# EAGLE design lazurite_rev3_3 (EAGLE 7.6.0)

## Sheet 1 of 2
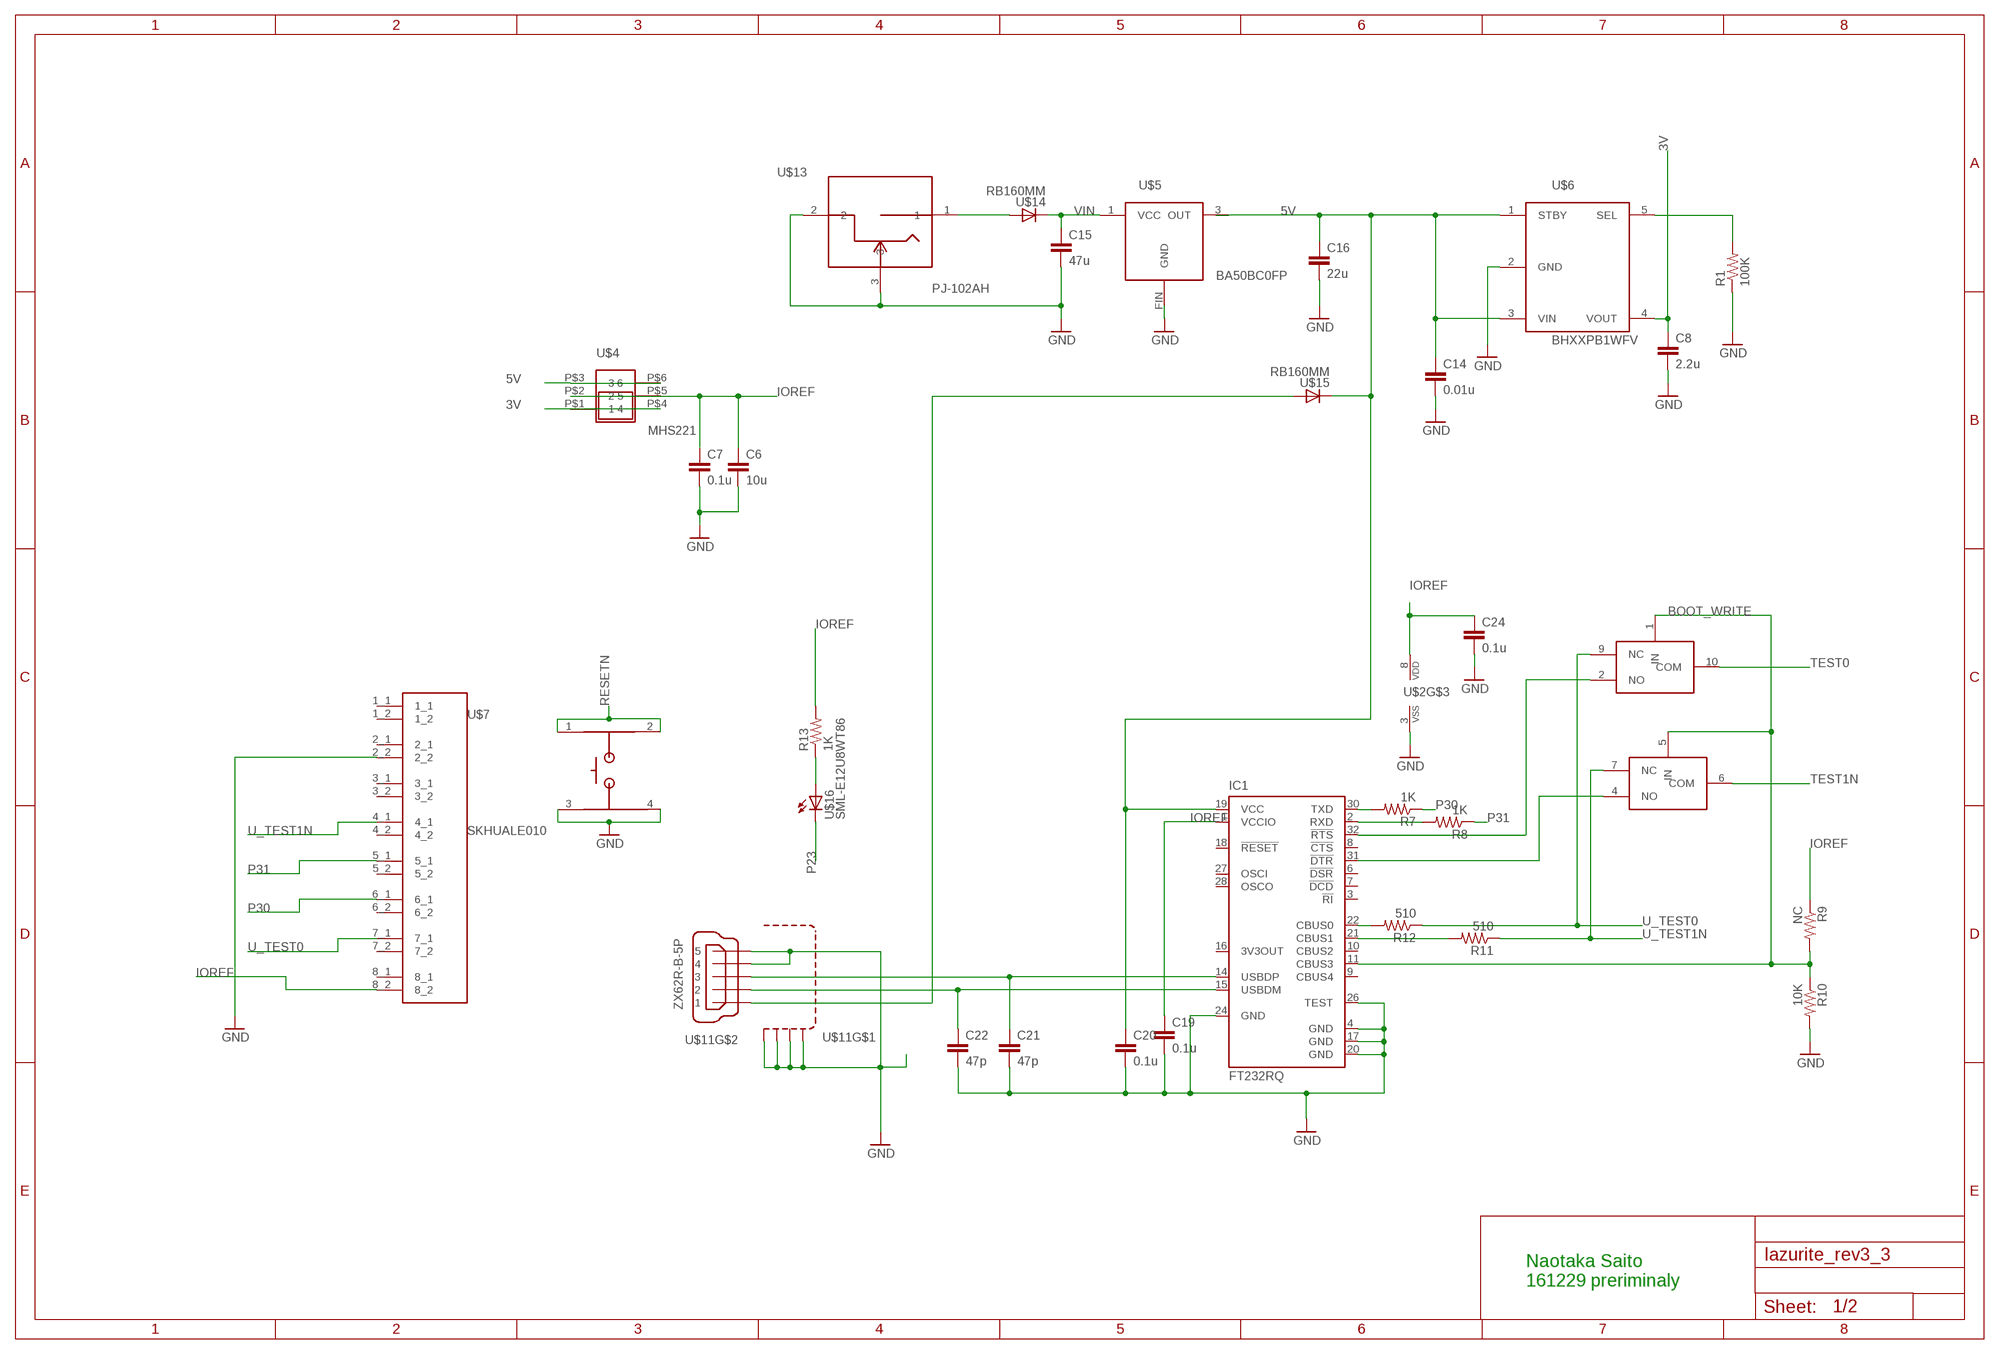
[diagram p0: schematic, sheet 1]

### Parts
C6  10u  C-EUC0402  [C0402]
C7  0.1u  C-EUC0402  [C0402]
C8  2.2u  C-EUC0402  [C0402]
C14  0.01u  C-EUC0402  [C0402]
C15  47u  C-EUC1210  [C1210]
C16  22u  C-EUC1206  [C1206]
C19  0.1u  C-EUC0402  [C0402]
C20  0.1u  C-EUC0402  [C0402]
C21  47p  C-EUC0402  [C0402]
C22  47p  C-EUC0402  [C0402]
C24  0.1u  C-EUC0402  [C0402]
IC1  FT232RQ  [QFN32]
R1  100K  R-US_R0402  [R0402]
R7  1K  R-US_R0402  [R0402]
R8  1K  R-US_R0402  [R0402]
R9  NC  R-US_R0402  [R0402]
R10  10K  R-US_R0402  [R0402]
R11  510  R-US_R0402  [R0402]
R12  510  R-US_R0402  [R0402]
R13  1K  R-US_R0402  [R0402]
U$2  TI-TS5A23159  [UQFN10]
U$4  MHS221  [MHS221]
U$5  BA50BC0FP  [TO252-3]
U$6  BHXXPB1WFV  [HVSOF5]
U$7  SKHUALE010  [SKHUALE010]
U$11  ZX62R-B-5P  MICRO-USB-SHIELD-ZX62R-B-5P  [ZX62R-B-5P]
U$12  XB-1-X  [XB-1-X]
U$13  PJ-102AH  [PJ-102H]
U$14  RB160MM  [RB160MM-30]
U$15  RB160MM  [RB160MM-30]
U$16  SML-E12U8WT86  SML-E1X  [SML-E1X]

### Nets
3V: C8.1 U$4.P$1 U$4.P$4 U$6.4(VOUT) ; also sheet 2
5V: C14.1 C16.1 C20.1 IC1.19(VCC) U$4.P$3 U$4.P$6 U$5.3(OUT) U$6.1(STBY) U$6.3(VIN) U$15.C ; also sheet 2
BOOT_WRITE: IC1.11(CBUS3) R9.2 R10.1 U$2.1(IN) U$2.5(IN)
DM: C22.1 IC1.15(USBDM) U$11.2
DP: C21.1 IC1.14(USBDP) U$11.3
GND: C6.2 C7.2 C8.2 C14.2 C15.2 C16.2 C19.2 C20.2 C21.2 C22.2 C24.2 IC1.4(GND) IC1.17(GND) IC1.20(GND) IC1.24(GND) IC1.26(TEST) R1.1 R10.2 U$2.3(VSS) U$5.FIN(GND) U$6.2(GND) U$7.3 U$7.4 U$11.4 U$11.5 U$11.M1(S1) U$11.M2(S2) U$11.M3(S3) U$11.M4(S4) U$12.2_2 U$13.2 U$13.3 ; also sheet 2
IOREF: C6.1 C7.1 C19.1 C24.1 IC1.1(VCCIO) R9.1 R13.2 U$2.8(VDD) U$4.P$2 U$4.P$5 U$12.8_2 ; also sheet 2
N$4: IC1.30(TXD) R7.2
N$6: IC1.22(CBUS0) R12.2
N$9: IC1.31(!DTR) U$2.4(NO)
N$10: IC1.2(RXD) R8.2
N$11: IC1.21(CBUS1) R11.2
N$16: R1.2 U$6.5(SEL)
N$17: IC1.32(!RTS) U$2.2(NO)
N$18: U$13.1 U$14.A
N$19: R13.1 U$16.A
P23: U$16.C ; also sheet 2
P30: R7.1 U$12.6_1 ; also sheet 2
P31: R8.1 U$12.5_1 ; also sheet 2
RESETN: U$7.1 U$7.2 ; also sheet 2
TEST0: U$2.10(COM) ; also sheet 2
TEST1N: U$2.6(COM) ; also sheet 2
U_TEST0: R12.1 U$2.9(NC) U$12.7_1
U_TEST1N: R11.1 U$2.7(NC) U$12.4_1
USBVDD: U$11.1 U$15.A
VIN: C15.1 U$5.1(VCC) U$14.C ; also sheet 2
Unconnected: IC1.3(!RI) IC1.6(!DSR) IC1.7(!DCD) IC1.8(!CTS) IC1.9(CBUS4) IC1.10(CBUS2) IC1.16(3V3OUT) IC1.18(!RESET) IC1.27(OSCI) IC1.28(OSCO) U$12.1_1 U$12.1_2 U$12.2_1 U$12.3_1 U$12.3_2 U$12.4_2 U$12.5_2 U$12.6_2 U$12.7_2 U$12.8_1

### Notes on the sheet
- Naotaka Saito
  161229 preriminaly

## Sheet 2 of 2
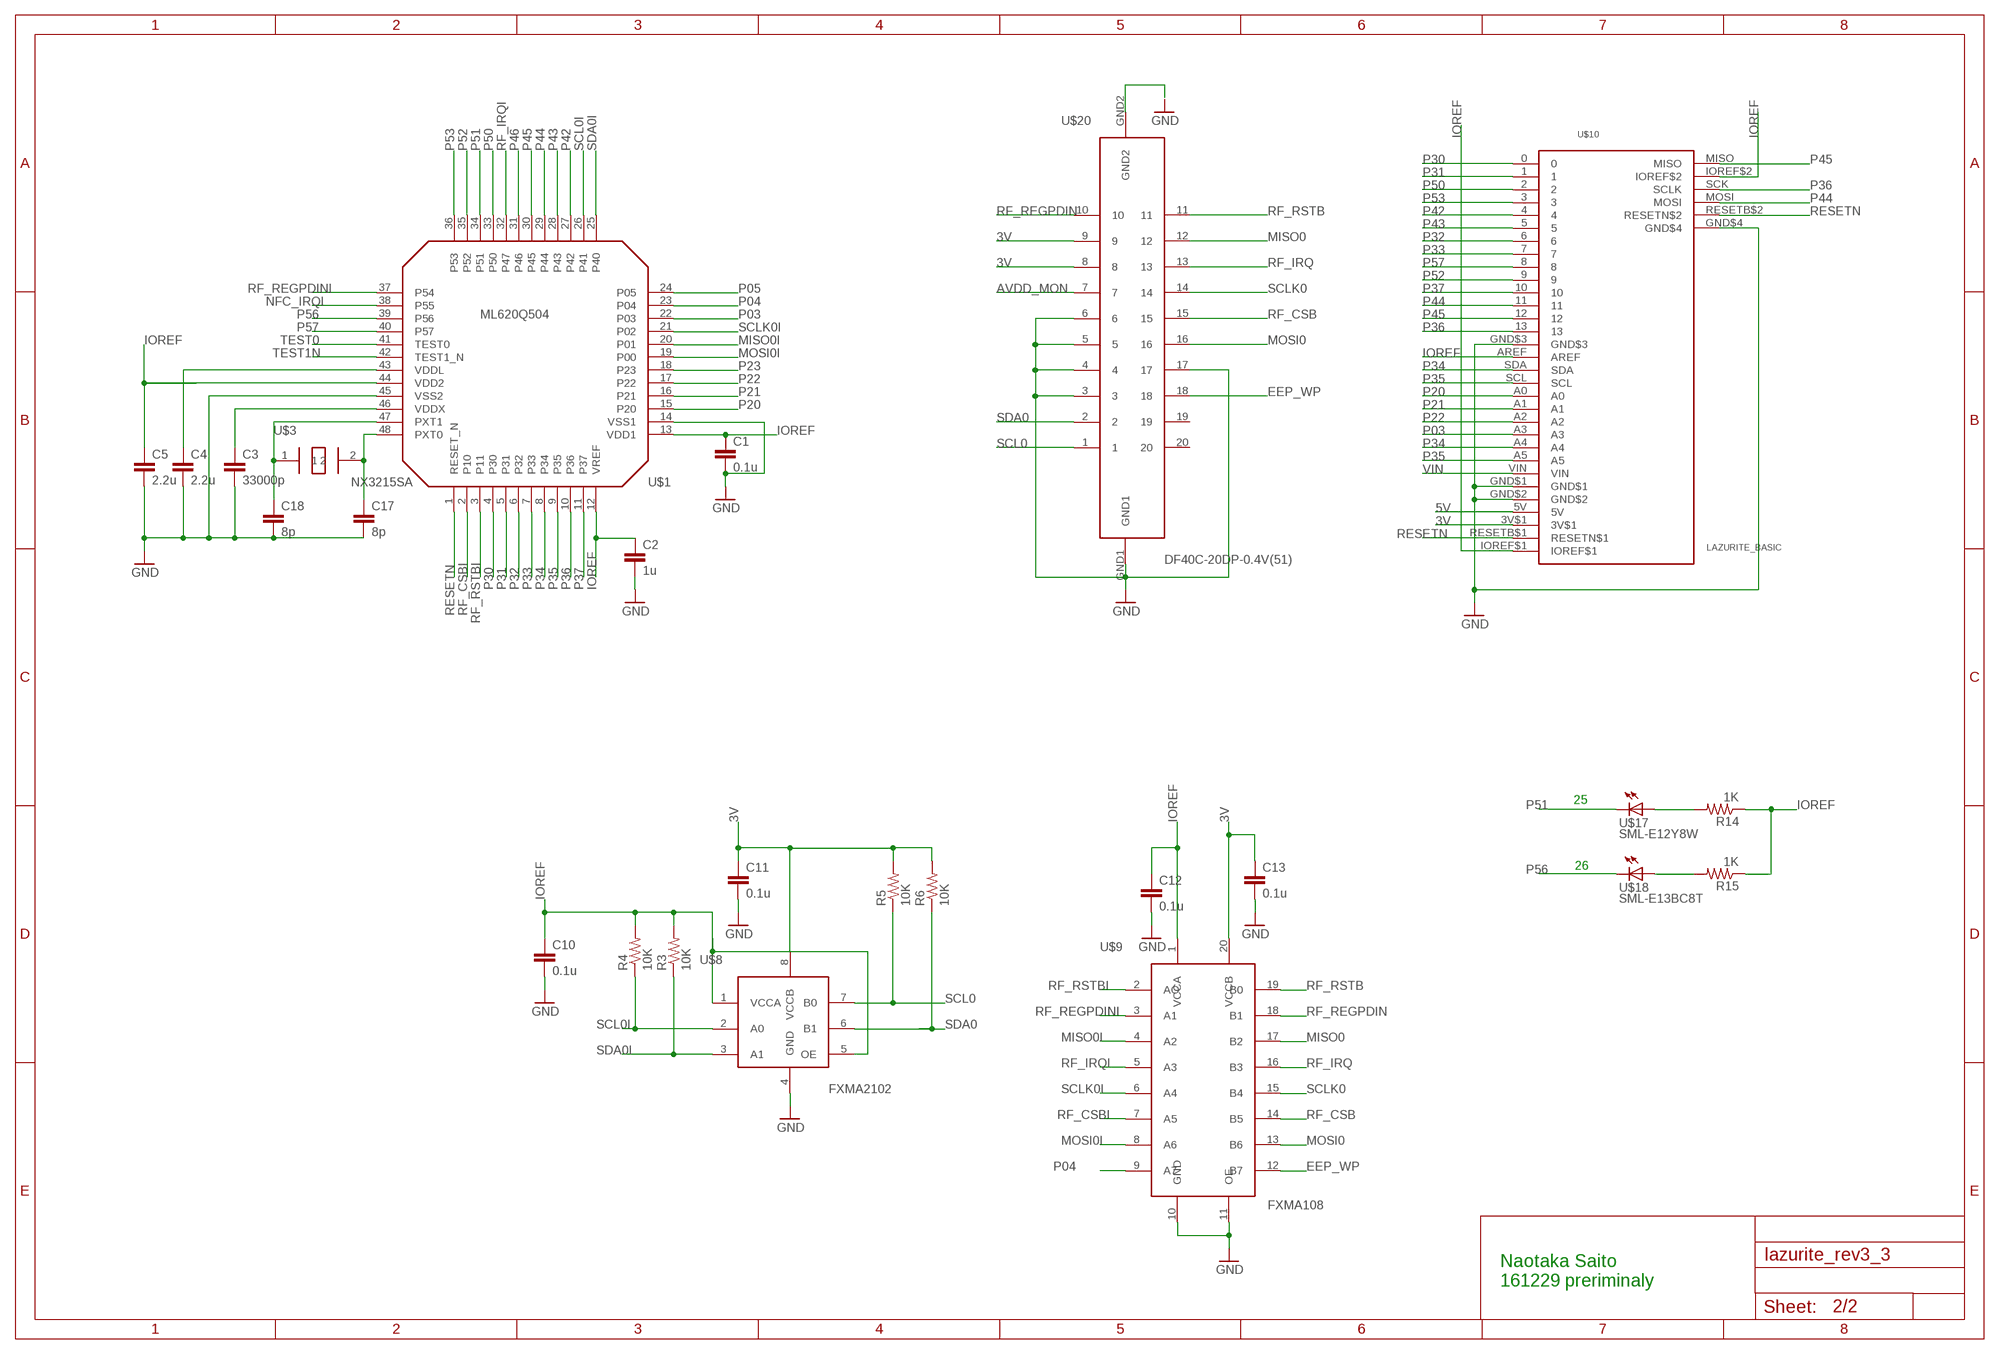
[diagram p1: schematic, sheet 2]

### Parts
C1  0.1u  C-EUC0402  [C0402]
C2  1u  C-EUC0402  [C0402]
C3  33000p  C-EUC0402  [C0402]
C4  2.2u  C-EUC0402  [C0402]
C5  2.2u  C-EUC0402  [C0402]
C10  0.1u  C-EUC0402  [C0402]
C11  0.1u  C-EUC0402  [C0402]
C12  0.1u  C-EUC0402  [C0402]
C13  0.1u  C-EUC0402  [C0402]
C17  8p  C-EUC0402  [C0402]
C18  8p  C-EUC0402  [C0402]
R3  10K  R-US_R0402  [R0402]
R4  10K  R-US_R0402  [R0402]
R5  10K  R-US_R0402  [R0402]
R6  10K  R-US_R0402  [R0402]
R14  1K  R-US_R0402  [R0402]
R15  1K  R-US_R0402  [R0402]
U$1  ML620Q504  [ML620Q504]
U$3  NX3215SA  [NX3215SA-32,768K-SFD-MUA-14]
U$8  FXMA2102  [MICROPACK]
U$9  FXMA108  [FXMA108]
U$10  LAZURITE_BASIC  [LAZURITE_BASIC]
U$17  SML-E12Y8W  SML-E1X  [SML-E1X]
U$18  SML-E13BC8T  SML-E1X  [SML-E1X]
U$20  DF40C-20DP-0.4V(51)  BP3596A  [BP3596A]

### Nets
3V: C11.1 C13.1 R5.2 R6.2 U$8.8(VCCB) U$9.20(VCCB) U$10.3V$1 U$20.8 U$20.9 ; also sheet 1
5V: U$10.5V ; also sheet 1
AVDD_MON: U$20.7
EEP_WP: U$9.12(B7) U$20.18
GND: C1.2 C2.2 C3.2 C4.2 C5.2 C10.2 C11.2 C12.2 C13.2 C17.2 C18.2 U$1.14(VSS1) U$1.45(VSS2) U$8.4(GND) U$9.10(GND) U$9.11(OE) U$10.GND$1 U$10.GND$2 U$10.GND$3 U$10.GND$4 U$20.3 U$20.4 U$20.5 U$20.6 U$20.17 U$20.GND1 ; also sheet 1
IOREF: C1.1 C2.1 C5.1 C10.1 C12.1 R3.2 R4.2 R14.1 R15.1 U$1.12(VREF) U$1.13(VDD1) U$1.44(VDD2) U$8.1(VCCA) U$8.5(OE) U$9.1(VCCA) U$10.AREF U$10.IOREF$1 U$10.IOREF$2 ; also sheet 1
MISO0: U$9.17(B2) U$20.12
MISO0I: U$1.20(P01) U$9.4(A2)
MOSI0: U$9.13(B6) U$20.16
MOSI0I: U$1.19(P00) U$9.8(A6)
N$1: C17.1 U$1.48(PXT0) U$3.2
N$2: C18.1 U$1.47(PXT1) U$3.1
N$3: C3.1 U$1.46(VDDX)
N$5: R14.2 U$17.A
N$7: C4.1 U$1.43(VDDL)
N$22: R15.2 U$18.A
N$24: U$20.GND2
NFC_IRQI: U$1.38(P55)
P03: U$1.22(P03) U$10.A3
P04: U$1.23(P04) U$9.9(A7)
P05: U$1.24(P05)
P20: U$1.15(P20) U$10.A0
P21: U$1.16(P21) U$10.A1
P22: U$1.17(P22) U$10.A2
P23: U$1.18(P23) ; also sheet 1
P30: U$1.4(P30) U$10.0 ; also sheet 1
P31: U$1.5(P31) U$10.1 ; also sheet 1
P32: U$1.6(P32) U$10.6
P33: U$1.7(P33) U$10.7
P34: U$1.8(P34) U$10.A4 U$10.SDA
P35: U$1.9(P35) U$10.A5 U$10.SCL
P36: U$1.10(P36) U$10.13 U$10.SCK(SCLK)
P37: U$1.11(P37) U$10.10
P42: U$1.27(P42) U$10.4
P43: U$1.28(P43) U$10.5
P44: U$1.29(P44) U$10.11 U$10.MOSI
P45: U$1.30(P45) U$10.12 U$10.MISO
P46: U$1.31(P46)
P50: U$1.33(P50) U$10.2
P51: U$1.34(P51) U$17.C
P52: U$1.35(P52) U$10.9
P53: U$1.36(P53) U$10.3
P56: U$1.39(P56) U$18.C
P57: U$1.40(P57) U$10.8
RESETN: U$1.1(RESET_N) U$10.RESETB$1(RESETN$1) U$10.RESETB$2(RESETN$2) ; also sheet 1
RF_CSB: U$9.14(B5) U$20.15
RF_CSBI: U$1.2(P10) U$9.7(A5)
RF_IRQ: U$9.16(B3) U$20.13
RF_IRQI: U$1.32(P47) U$9.5(A3)
RF_REGPDIN: U$9.18(B1) U$20.10
RF_REGPDINI: U$1.37(P54) U$9.3(A1)
RF_RSTB: U$9.19(B0) U$20.11
RF_RSTBI: U$1.3(P11) U$9.2(AO)
SCL0: R5.1 U$8.7(B0) U$20.1
SCL0I: R4.1 U$1.26(P41) U$8.2(A0)
SCLK0: U$9.15(B4) U$20.14
SCLK0I: U$1.21(P02) U$9.6(A4)
SDA0: R6.1 U$8.6(B1) U$20.2
SDA0I: R3.1 U$1.25(P40) U$8.3(A1)
TEST0: U$1.41(TEST0) ; also sheet 1
TEST1N: U$1.42(TEST1_N) ; also sheet 1
VIN: U$10.VIN ; also sheet 1
Unconnected: U$20.19 U$20.20

### Notes on the sheet
- 25
- 26
- Naotaka Saito
  161229 preriminaly

## Library data of the parts
C1-C8 C10-C22 C24 = rcl:C-EU: CAPACITOR, European symbol
IC1 = ftdichip:FT232R: Source: http://www.ftdichip.com/Documents/DataSheets/DS_FT232R_v104.pdf; MPN: FT232RQ; OC_FARNELL: 1146033; OC_NEWARK: 91K9919
R1 R3-R15 = rcl:R-US_: RESISTOR, American symbol
U$1 = lazurite:ML620Q504
U$2 = lz-shield:TI-TS5A23159
U$3 = lazurite:NX3215SA
U$4 = lazurite:MHS221
U$5 = lazurite:BA50BC0FP
U$6 = lazurite:BHXXPB1WFV
U$7 = lazurite:SKHUALE010
U$8 = lazurite:FXMA2102
U$9 = lazurite:FXMA108
U$10 = lazurite:LAZURITE_BASIC
U$11 = con-hirose:MICRO-USB-SHIELD-: Hirose Micro USB Connector ZX62R-B-5P: Micro B, reverse (top mount) shell SMT Supplier: DigiKey H11574CT-ND Source: http://www.hirose.co.jp/cataloge_hp/e24200011.pdf
U$12 = lz-shield:XB-1-X
U$13 = lazurite:PJ-102AH
U$14 U$15 = lazurite:RB160MM
U$16-U$18 = lazurite:SML-E1X
U$20 = lazurite:BP3596A

## Board
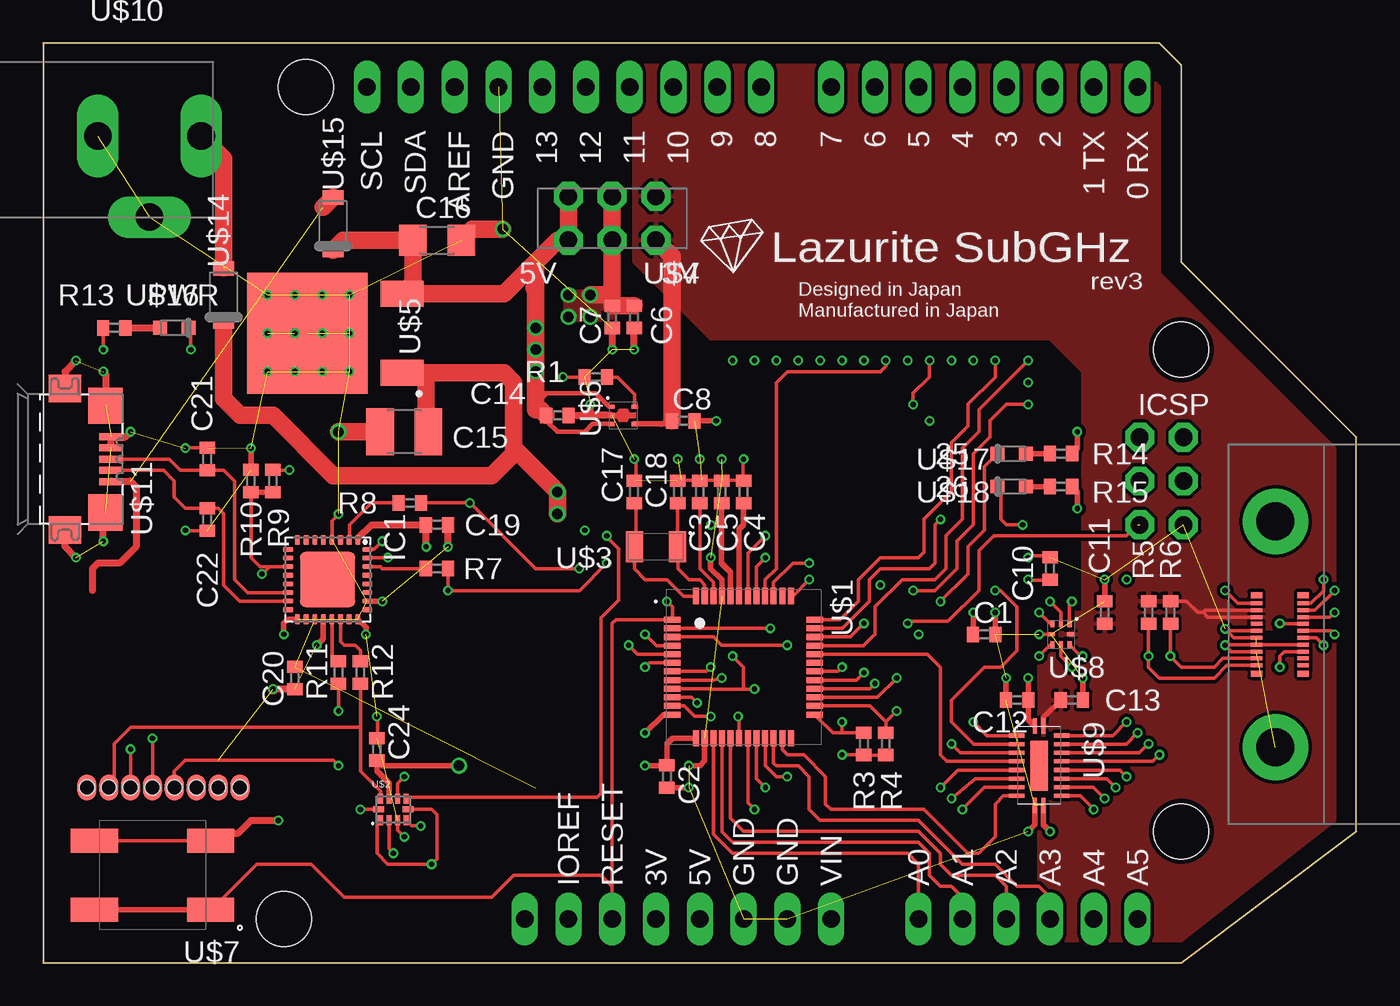
[diagram p2: board, top side]
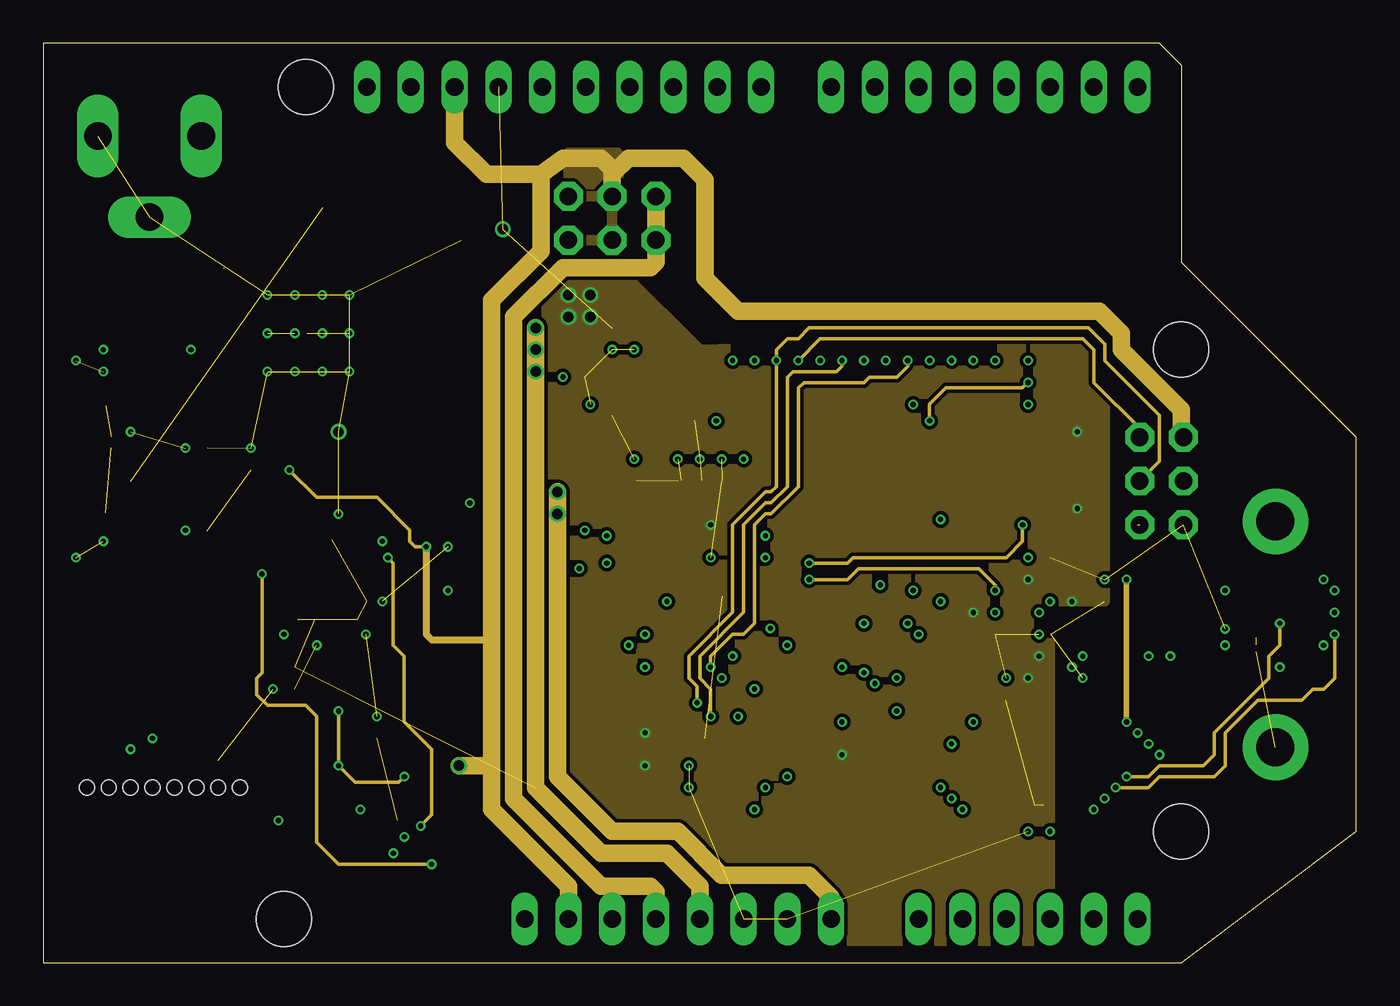
[diagram p3: board, inner layer Route2]
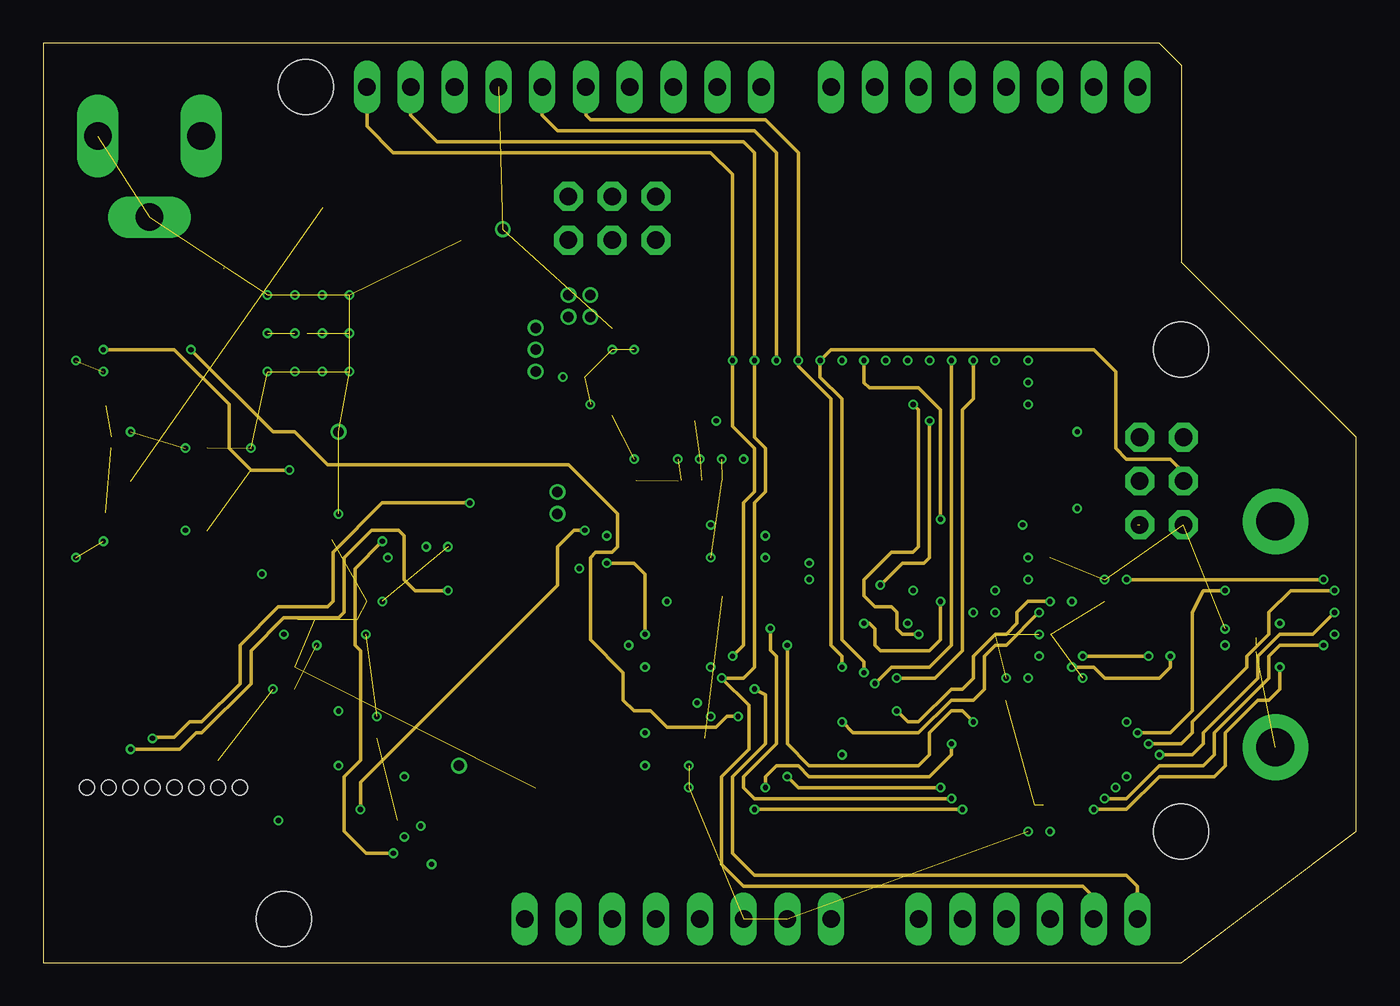
[diagram p4: board, inner layer Route3]
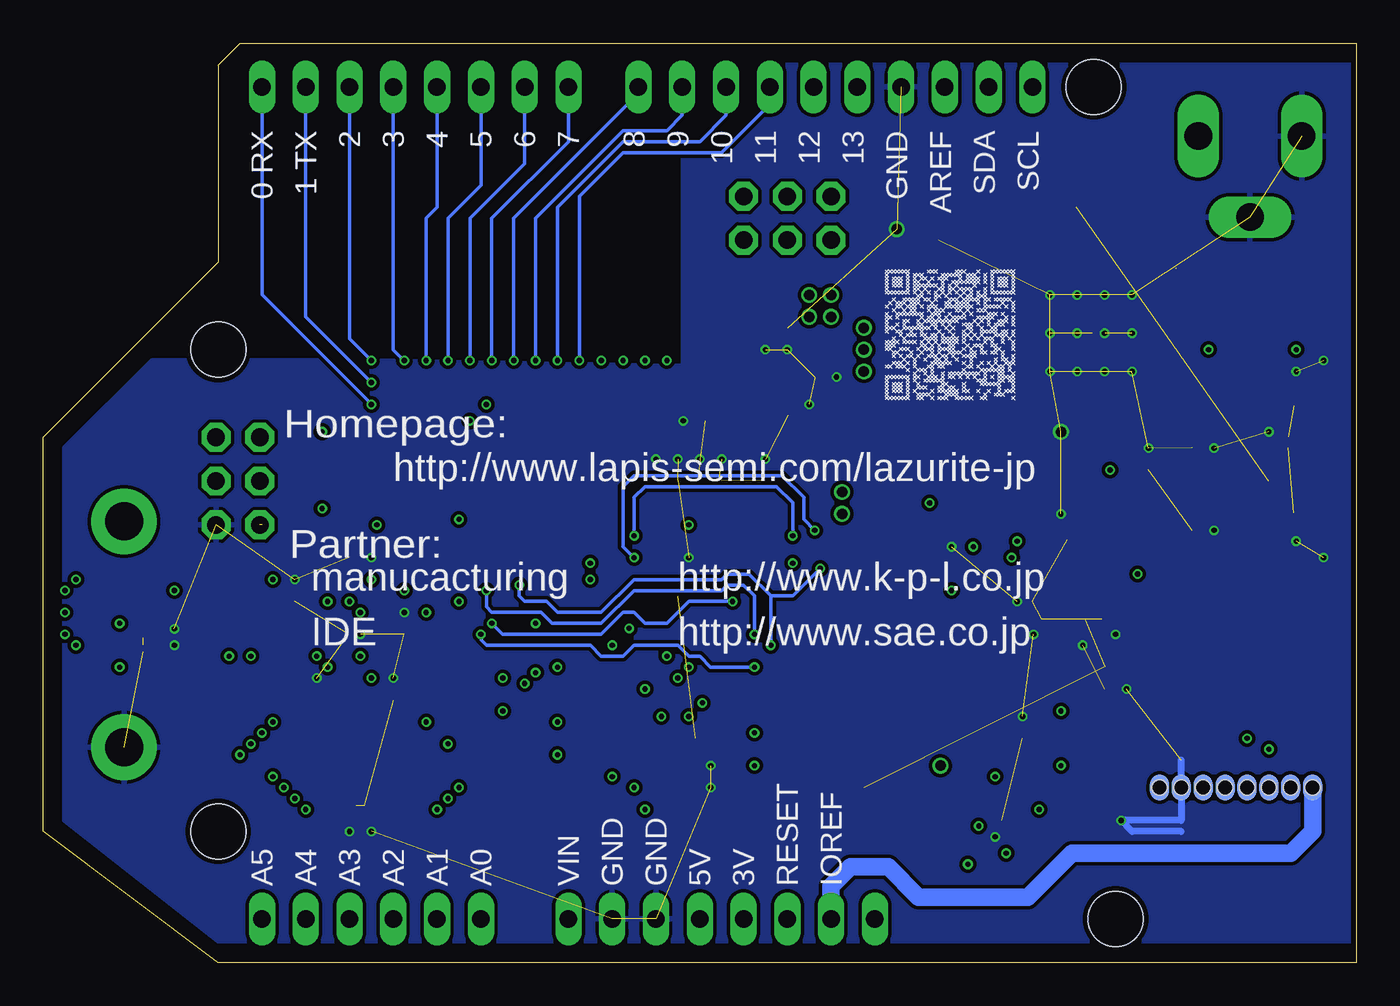
[diagram p5: board, bottom side, seen from below]

Size 76.2 x 53.34 mm. Coordinates in mm from the lower left corner, seen from the top.
Outline: 0,0 66.04,0 76.2,7.62 76.2,30.48 66.04,40.64 66.04,52.07 64.77,53.34 0,53.34 0,0
Copper layers (1+2*3+16): Top 0.018mm / dielectric 0.36mm / Route2 0.035mm / dielectric 0.71mm / Route3 0.035mm / dielectric 0.36mm / Bottom 0.018mm
Design rules "unicraft_4_layer": minimum track width 0.125mm, minimum drill 0.3mm, track to track 0.125mm, track to pad 0.125mm, pad to pad 0.125mm, via to via 0.125mm, smd to smd 0mil, copper to edge 0.3mm, drill to drill 0.2mm, minimum pad ring 0.125mm, minimum via ring 0.125mm, stop-mask expansion 2mil, vias tented up to drill 0.45mm, thermal gap 0.2mm

### Footprints (pad centres in the part's own frame; a part is rotated, then mirrored left to right if it is on the bottom)
C0402 = smd 0.7 x 0.9: 1 -0.65,0; 2 0.65,0
C1210 = smd 1.6 x 2.7: 1 -1.4,0; 2 1.4,0
C1206 = smd 1.6 x 1.8: 1 -1.4,0; 2 1.4,0
QFN32 = smd 0.6 x 0.3: 1 -2.3,1.75; 2 -2.3,1.25; 3 -2.3,0.75; 4 -2.3,0.25; 5 -2.3,-0.25; 6 -2.3,-0.75; 7 -2.3,-1.25; 8 -2.3,-1.75; 17 2.3,-1.75; 18 2.3,-1.25; 19 2.3,-0.75; 20 2.3,-0.25; 21 2.3,0.25; 22 2.3,0.75; 23 2.3,1.25; 24 2.3,1.75 | smd 0.3 x 0.6: 9 -1.75,-2.3; 10 -1.25,-2.3; 11 -0.75,-2.3; 12 -0.25,-2.3; 13 0.25,-2.3; 14 0.75,-2.3; 15 1.25,-2.3; 16 1.75,-2.3; 25 1.75,2.3; 26 1.25,2.3; 27 0.75,2.3; 28 0.25,2.3; 29 -0.25,2.3; 30 -0.75,2.3; 31 -1.25,2.3; 32 -1.75,2.3 | smd 3.2 x 3.2: EXP 0,0
R0402 = smd 0.7 x 0.9: 1 -0.65,0; 2 0.65,0
ML620Q504 = smd 0.35 x 0.95: 1 -2.75,-4.125; 2 -2.25,-4.125; 3 -1.75,-4.125; 4 -1.25,-4.125; 5 -0.75,-4.125; 6 -0.25,-4.125; 7 0.25,-4.125; 8 0.75,-4.125; 9 1.25,-4.125; 10 1.75,-4.125; 11 2.25,-4.125; 12 2.75,-4.125; 25 2.75,4.125; 26 2.25,4.125; 27 1.75,4.125; 28 1.25,4.125; 29 0.75,4.125; 30 0.25,4.125; 31 -0.25,4.125; 32 -0.75,4.125; 33 -1.25,4.125; 34 -1.75,4.125; 35 -2.25,4.125; 36 -2.75,4.125 | smd 0.95 x 0.35: 13 4.125,-2.75; 14 4.125,-2.25; 15 4.125,-1.75; 16 4.125,-1.25; 17 4.125,-0.75; 18 4.125,-0.25; 19 4.125,0.25; 20 4.125,0.75; 21 4.125,1.25; 22 4.125,1.75; 23 4.125,2.25; 24 4.125,2.75; 37 -4.125,2.75; 38 -4.125,2.25; 39 -4.125,1.75; 40 -4.125,1.25; 41 -4.125,0.75; 42 -4.125,0.25; 43 -4.125,-0.25; 44 -4.125,-0.75; 45 -4.125,-1.25; 46 -4.125,-1.75; 47 -4.125,-2.25; 48 -4.125,-2.75
UQFN10 = smd 0.3 x 0.58: 1 -0.75,-0.635; 2 -0.25,-0.635; 3 0.25,-0.635; 4 0.75,-0.635; 6 0.75,0.635; 7 0.25,0.635; 8 -0.25,0.635; 9 -0.75,0.635 | smd 0.63 x 0.35: 5 0.86,0; 10 -0.86,0
NX3215SA-32,768K-SFD-MUA-14 = smd 1 x 1.8: 1 -1.25,0; 2 1.25,0
MHS221 = drill 1.016 pad 1.676 octagon: P$1 -2.54,1.27; P$2 0,1.27; P$3 2.54,1.27; P$4 -2.54,-1.27; P$5 0,-1.27; P$6 2.54,-1.27
TO252-3 = smd 1.5 x 2.5: 1 -2.3,-4; 3 2.3,-4 | smd 7 x 7: FIN 0,1.5
HVSOF5 = smd 0.25 x 0.35: 1 0.5,0.675; 2 0,0.675; 3 -0.5,0.675; 4 -0.5,-0.675; 5 0.5,-0.675
SKHUALE010 = smd 2.75 x 1.4: 1 -3.375,2; 2 3.375,2; 3 -3.375,-2; 4 3.375,-2
MICROPACK = smd 0.25 x 0.4: 1 -0.5,-0.605; 2 0,-0.605; 3 0.5,-0.605; 5 0.5,0.605; 6 0,0.605; 7 -0.5,0.605 | smd 0.45 x 0.25: 4 0.575,0; 8 -0.575,0
FXMA108 = smd 0.9 x 0.24: 1 -2.3,-0.25; 10 2.3,-0.25; 11 2.3,0.25; 20 -2.3,0.25 | smd 0.24 x 0.9: 2 -1.75,-1.3; 3 -1.25,-1.3; 4 -0.75,-1.3; 5 -0.25,-1.3; 6 0.25,-1.3; 7 0.75,-1.3; 8 1.25,-1.3; 9 1.75,-1.3; 12 1.75,1.3; 13 1.25,1.3; 14 0.75,1.3; 15 0.25,1.3; 16 -0.25,1.3; 17 -0.75,1.3; 18 -1.25,1.3; 19 -1.75,1.3 | smd 2.9 x 1: 21 0,0
LAZURITE_BASIC = drill 1.016 long: 0 63.5,50.8; 1 60.96,50.8; 2 58.42,50.8; 3 55.88,50.8; 3V$1 35.56,2.54; 4 53.34,50.8; 5 50.8,50.8; 5V 38.1,2.54; 6 48.26,50.8; 7 45.72,50.8; 8 41.656,50.8; 9 39.116,50.8; 10 36.576,50.8; 11 34.036,50.8; 12 31.496,50.8; 13 28.956,50.8; A0 50.8,2.54; A1 53.34,2.54; A2 55.88,2.54; A3 58.42,2.54; A4 60.96,2.54; A5 63.5,2.54; AREF 23.876,50.8; GND$1 43.18,2.54; GND$2 40.64,2.54; GND$3 26.416,50.8; IOREF$1 30.48,2.54; NC$1 27.94,2.54; RESETB$1 33.02,2.54; SCL 18.796,50.8; SDA 21.336,50.8; VIN 45.72,2.54 | drill 1.016 pad 1.676 octagon: GND$4 66.167,25.4; IOREF$2 66.167,30.48; MISO 63.627,30.48; MOSI 66.167,27.94; RESETB$2 63.627,25.4; SCK 63.627,27.94 | hole 3.175: 15.24,50.8; 13.97,2.54; 66.04,7.62; 66.04,35.56
ZX62R-B-5P = smd 1.35 x 0.4: 1 2.675,-1.3; 2 2.675,-0.65; 3 2.675,0; 4 2.675,0.65; 5 2.675,1.3 | smd 1.9 x 1.6: M1 0,-4.1; M2 0,4.1 | smd 2 x 2.1: M3 2.35,3.1; M4 2.35,-3.1
XB-1-X = smd 1.1 x 1.5: 1_1 -5.08,0; 2_1 -3.81,0; 3_1 -2.54,0; 4_1 -1.27,0; 5_1 0,0; 6_1 1.27,0; 7_1 2.54,0; 8_1 3.81,0 | smd 1.1 x 1.5 bottom: 1_2 -5.08,0; 2_2 -3.81,0; 3_2 -2.54,0; 4_2 -1.27,0; 5_2 0,0; 6_2 1.27,0; 7_2 2.54,0; 8_2 3.81,0 | hole 0.85: -5.08,0; -3.81,0; -2.54,0; -1.27,0; 0,0; 1.27,0; 2.54,0; 3.81,0
PJ-102H = drill 1.6 pad 2.4 long: 1 0,-6; 2 0,0; 3 -4.7,-3
RB160MM-30 = smd 1.2 x 0.85: A 0,1.525; C 0,-1.525
SML-E1X = smd 0.8 x 0.8: A 0,-0.825; C 0,0.825
BP3596A = smd 0.23 x 0.66: 1 1.8,-1.355; 2 1.4,-1.355; 3 1,-1.355; 4 0.6,-1.355; 5 0.2,-1.355; 6 -0.2,-1.355; 7 -0.6,-1.355; 8 -1,-1.355; 9 -1.4,-1.355; 10 -1.8,-1.355; 11 -1.8,1.355; 12 -1.4,1.355; 13 -1,1.355; 14 -0.6,1.355; 15 -0.2,1.355; 16 0.2,1.355; 17 0.6,1.355; 18 1,1.355; 19 1.4,1.355; 20 1.8,1.355 | drill 2.2 pad 3.81: GND1 6.55,-0.25; GND2 -6.55,-0.25 | smd 0.35 x 0.66: NC1 2.275,-1.355; NC2 -2.275,-1.355; NC3 -2.275,1.355; NC4 2.275,1.355

### Placement (x,y rotation side)
C1  54.61,19.05 0 top
C2  36.2,10.79 270 top
C3  38.1,27.3 90 top
C4  40.64,27.3 90 top
C5  39.37,27.3 90 top
C6  34.29,37.47 270 top
C7  33.02,37.47 270 top
C8  37.15,31.43 0 top
C10  58.42,22.86 90 top
C11  61.59,20.32 90 top
C12  56.52,15.24 180 top
C13  59.69,15.24 0 top
C14  29.84,31.75 0 top
C15  20.95,30.8 180 top
C16  22.86,41.91 0 top
C17  34.29,27.3 90 top
C18  36.83,27.3 90 top
C19  22.86,25.4 0 top
C20  14.61,16.51 270 top
C21  9.53,29.21 90 top
C22  9.53,25.72 270 top
C24  19.37,12.38 90 top
IC1  16.51,22.23 270 top
R1  32.07,33.97 0 top
R3  47.62,12.7 270 top
R4  48.9,12.7 270 top
R5  64.14,20.32 90 top
R6  65.41,20.32 90 top
R7  22.86,22.86 180 top
R8  21.27,26.67 180 top
R9  13.34,27.94 270 top
R10  12.06,27.94 90 top
R11  17.14,16.83 90 top
R12  18.41,16.83 90 top
R13  4.13,36.83 180 top
R14  59.05,29.53 180 top
R15  59.05,27.62 180 top
U$1  40.64,17.14 270 top
U$2  20.32,8.89 0 top
U$3  35.56,24.13 180 top
U$4  33.02,43.18 180 top
U$5  16.83,36.51 90 top
U$6  33.66,31.75 90 top
U$7  6.35,5.08 180 top
U$8  59.05,19.05 180 top
U$9  57.78,11.43 270 top
U$10  0,0 0 top
U$11  1.27,29.21 0 top
U$12  6.35,10.16 180 top
U$13  3.17,47.94 90 top
U$14  10.48,38.73 0 top
U$15  16.83,42.86 0 top
U$16  7.62,36.83 270 top
U$17  56.2,29.53 90 top
U$18  56.2,27.62 90 top
U$19  [LOGO]  37.47,41.91 330 top
U$20  71.75,19.05 270 top
U$21  [QRCODE]  23.5,36.51 0 bottom

### Tracks (layer width: path | path; a pad name or v marks a point on that pad's centre or on a via)
3V
  Top 0.203: U$20.8 67.58,20.05 67.31,20.32 | 67.31,20.32 66.99,20.32 66.34,20.97 R6.2 | U$20.9 67.44,20.45 67.31,20.32
  Top 0.305: 35.86,31.24 C8.1 | U$9.20 58.03,14.23 C13.1 | U$6.4 36.31,31.25
  Top 0.406: 36.31,31.25 C8.1
  Top 1.016: C8.1 36.5,40.97 U$4.P$1
  Route2 1.016: U$4.P$4 U$4.P$1 35.56,40.64 35.24,40.32 30.16,40.32 27.3,37.47 27.3,9.53 32.38,4.45 35.24,4.45 35.56,4.13 U$10.3V$1
  pour Top (isolate 0.203): 34.29,52.07 63.5,52.07 64.77,50.8 64.77,40.01 74.93,29.84 74.93,19.37 70.8,19.37 70.8,20.64 69.85,20.64 69.85,17.46 70.8,17.46 70.8,19.05 74.93,19.05 74.93,8.26 66.04,1.27 57.78,1.27 57.78,20.32 60.33,20.32 60.33,34.29 58.42,36.2 38.73,36.2 34.29,40.64
5V  (via drill 0.61)  (2 unrouted)
  Top 0.254: U$6.3 31.89,31.25 31.43,30.8 29.84,30.8 29.2,31.45 C14.1 | U$6.1 32.84,32.25 32.07,33.02 29.21,33.02 | 29.21,33.02 28.57,33.02 | 28.57,32.07 28.57,32.38 29.21,33.02
  Top 1.016: 28.57,39.05 v28.57,36.83 v28.57,35.56 v28.57,34.29 28.57,32.07 28.88,32.07 C14.1 | 28.57,39.05 28.57,40.64 | 28.5,39.13 28.57,39.05 | U$15.C 17.4,41.91 C16.1 21.46,39.45 U$5.3 26.75,38.81 28.57,40.64 | 28.57,40.64 29.84,41.91 U$4.P$3 U$4.P$6
  Route2 1.016: v28.57,36.83 28.57,10.16 32.38,6.35 36.2,6.35 38.1,4.45 U$10.5V
BOOT_WRITE  (via drill 0.3)
  Top 0.203: R10.1 12.06,23.5 12.59,22.98 IC1.11 13.13,22.98 v12.7,22.54 | U$2.1 19.37,8.05 19.37,6.35 20,5.71 v22.54,5.71 22.86,6.03 22.86,8.57 22.54,8.89 U$2.5
  Top 0.305: R10.1 R9.2
  Route2 0.203: v12.7,22.54 12.7,16.83 12.38,16.51 12.38,15.56 13.02,14.92 15.24,14.92 15.88,14.29 15.88,6.99 17.14,5.71 v22.54,5.71
DM
  Top 0.203: 14.19,20.95 IC1.15 11.41,20.98 10.48,21.91 10.48,26.04 10.16,26.35 9.54,26.35 C22.1 8.24,26.37 7.62,26.99 7.62,27.94 6.99,28.57 3.96,28.57 U$11.2
DP
  Top 0.203: IC1.14 11.86,21.48 11.11,22.23 11.11,27.94 10.48,28.57 9.54,28.57 C21.1 7.95,28.56 7.3,29.21 U$11.3
EEP_WP  (via drill 0.3)
  Top 0.203: U$9.12 60.17,9.68 v60.96,8.89 | v71.75,17.14 71.75,17.78 72.03,18.05 U$20.18
  Route3 0.203: v71.75,17.14 71.75,15.88 71.12,15.24 70.48,15.24 68.58,13.34 68.58,11.43 67.94,10.79 64.77,10.79 62.87,8.89 v60.96,8.89
GND  (via drill 0.3, 0.61)  (61 unrouted)
  Top 0.2: C18.2 37,28 38,28 C3.2 38.2,28 39.2,28 C5.2 39.4,28 40.6,28 | 19,21 IC1.26 | C24.2 19.4,13.2 19.4,14.2 v19.37,14.29 | C10.2 58.4,23.6 57.2,23.6 v57.15,23.5 | C17.2 34.4,28 34.4,29.2 v34.29,29.21 | 40.6,28 40.6,29.2 v40.64,29.21 | 40.6,28 C4.2
  Top 0.203: IC1.4 16.76,25.65 v17.14,26.04 | R1.1 v30.16,33.97 | C1.2 55.24,19.07 | U$2.3 20.57,7.69 v20.95,7.3 | U$7.4 U$7.3 10.16,7.51 | v8.26,29.84 8.27,29.86 C21.2 | v8.26,25.08 8.27,25.07 C22.2 | U$20.3 68.94,18.05 v68.58,18.41 68.61,18.45 U$20.4 U$20.17 | U$20.5 69.1,18.85 v68.58,19.37 68.7,19.25 U$20.6 | U$8.4 v57.78,19.05
  Top 0.305: v38.73,23.5 38.73,22.86 39.39,22.2 U$1.45 | C8.2 v39.05,31.43 | 55.24,19.07 v55.24,20.32 | U$9.10 57.53,8.01 v57.15,7.62 | U$9.11 58.03,8.01 v58.42,7.62 | R10.2 v12.06,29.84 | C12.2 55.87,16.5 v55.88,16.51 | v60.33,16.51 60.33,15.26 C13.2 | v37.47,10.16 36.21,10.16 C2.2 | U$1.14 38.39,11.72 38.1,11.43 v37.47,11.43 | C11.2 v61.59,22.23 | IC1.20 16.26,18.8 v15.88,18.41 | IC1.17 14.21,19.93 13.97,19.68 v13.97,19.05 | IC1.24 18.73,19.45 v18.73,19.05 | v19.68,20.95 19.66,20.98 IC1.26
  Top 0.406: v34.29,35.56 C6.2 | C14.2 31.75,31.75 | 31.75,31.75 v31.75,32.38 | U$6.2 31.75,31.75 | 10.16,7.51 11.32,7.51 12.06,8.26 v13.65,8.26 | v1.91,23.5 1.27,24.13 U$11.M1 | v3.49,24.45 3.49,25.98 U$11.M4 | v1.91,34.92 1.27,34.29 U$11.M2 | v3.49,34.29 3.62,34.16 U$11.M3 | v5.08,30.8 4.76,30.48 3.98,30.48 U$11.5 U$11.4 | C20.2 14.59,15.88 v13.34,15.88 | C7.2 v33.02,35.56 | v23.5,24.13 23.51,24.14 C19.2
  Top 0.61: 13.35,15.86 v13.34,15.88
  Top 1.016: v17.14,30.8 C15.2 | C16.2 24.89,42.55 v26.67,42.55 | v14.61,36.51 U$5.FIN
  Bottom 0.406: 10.16,7.62 13.02,7.62 v13.65,8.26 10.16,8.26 U$12.2_2 10.16,11.75
  other vias: 38.1,29.21 39.37,29.21 36.83,29.21 16.19,38.73 17.78,38.73 14.61,38.73 13.02,38.73 13.02,36.51 17.78,34.29 16.19,34.29 14.61,34.29 13.02,34.29 17.78,36.51 16.19,36.51
  pour Bottom (isolate 0.203): 0,52.07 39.05,52.07 39.05,34.61 57.47,34.92 69.85,34.92 74.93,29.84 74.93,8.26 66.04,1.27 0,1.27
IOREF  (via drill 0.3, 0.61)
  Top 0.2: v57.15,22.23 57.2,22.2 58.4,22.2 C10.1 58.6,22.4
  Top 0.203: IC1.1 18.26,24.61 | v59.69,20.95 59.55,20.82 U$8.1 | 58.55,18.55 U$8.5 58.45,18.45 v57.78,17.78 | v46.35,12.06 47.61,12.06 R3.2 R4.2 | 20,9.59 U$2.8 | R9.1 13.35,28.57 v14.29,28.57 | R13.2 3.49,36.83 v3.49,35.56
  Top 0.305: C5.1 39.37,25.4 | 39.37,25.4 39.37,23.18 39.89,22.66 U$1.44 | v38.73,25.4 39.37,25.4 | C1.1 53.98,19.07 v53.98,20.32 | v57.15,16.51 57.16,16.5 C12.1 57.16,14.1 U$9.1 | U$1.13 36.52,13.02 36.2,12.7 C2.1 36.21,11.43 v34.92,11.43 | U$1.12 35.98,14.39 v34.92,13.34 | U$2.8 20.07,10.41 19.37,11.11 C24.1 19.67,11.43 v24.13,11.43 | R15.1 60.01,27.32 v60.01,26.35 | R14.1 60.01,29.83 v60.01,30.8
  Top 0.406: 18.26,24.61 19.05,25.4 C19.1 22.21,24.14 v22.23,24.13
  Top 1.016: C6.1 C7.1 | C7.1 U$4.P$5 | C7.1 33.01,38.73 v31.75,38.73
  Route2 0.203: v14.29,28.57 15.88,26.99 19.37,26.99 21.27,25.08 21.27,24.45 21.59,24.13 v22.23,24.13
  Route2 0.406: v22.23,24.13 22.23,19.05 22.54,18.73 25.72,18.73 26.04,19.05
  Route2 1.016: 28.89,45.72 28.89,41.27 26.04,38.42 26.04,19.05 26.04,11.43 | 28.89,45.72 30.16,46.67 32.38,46.67 33.02,46.04 U$4.P$5 33.02,45.72 33.97,46.67 37.15,46.67 38.42,45.4 38.42,39.69 40.32,37.78 61.28,37.78 62.55,36.51 62.55,35.56 66.04,32.07 66.04,30.61 U$10.IOREF$2 | 26.04,11.43 26.04,8.89 30.48,4.45 U$10.IOREF$1 | v24.13,11.43 26.04,11.43 | 28.89,45.72 25.72,45.72 23.88,47.56 U$10.AREF
  Route3 0.203: v14.29,28.57 12.06,28.57 10.79,29.84 10.79,32.38 7.62,35.56 v3.49,35.56
  Bottom 1.016: U$12.8_2 2.54,7.62 3.81,6.35 16.51,6.35 19.05,3.81 25.4,3.81 27.15,5.56 29.37,5.56 30.48,4.45 U$10.IOREF$1
  other vias: 31.75,37.47 30.48,37.47 30.48,38.73
  pour Route2 (isolate 0.203): 58.42,1.27 38.1,1.27 38.1,6.35 36.83,7.62 33.02,7.62 29.84,10.16 29.21,38.1 30.48,39.37 30.48,46.99 33.34,46.99 33.66,40.01 38.1,35.56 61.59,36.2 61.59,20.95 58.42,20.95
  pour Top: 33.02,38.73 30.48,38.73 30.48,37.47 33.02,37.47
MISO0  (via drill 0.3)
  Top 0.203: v74.93,21.59 73.79,20.45 U$20.12 | U$9.17 63.62,12.18 v64.14,12.7
  Route3 0.203: v64.14,12.7 66.04,12.7 66.67,13.34 66.67,13.97 69.85,17.14 69.85,17.78 71.12,19.05 71.12,20.32 72.39,21.59 v74.93,21.59
MISO0I  (via drill 0.3)
  Top 0.203: U$9.4 53.23,12.18 v52.7,12.7 | v41.91,10.16 41.39,10.68 U$1.20
  Route3 0.203: v41.91,10.16 41.91,10.79 42.55,11.43 43.81,11.43 44.45,10.79 51.44,10.79 52.7,12.06 v52.7,12.7
MOSI0  (via drill 0.3)
  Top 0.203: U$9.13 60.94,10.18 v61.59,9.53 | U$20.16 73.86,18.85 v74.3,18.41
  Route3 0.203: v61.59,9.53 62.87,9.53 64.77,11.43 67.31,11.43 67.94,12.06 67.94,13.34 71.12,16.51 71.12,17.78 71.75,18.41 v74.3,18.41
MOSI0I  (via drill 0.3)
  Top 0.203: U$9.8 54.63,10.18 v53.34,8.89 | v41.27,8.89 40.89,9.28 U$1.19
  Route3 0.203: v53.34,8.89 v41.27,8.89
N$1
  Top 0.2: C17.1 34.4,26.6 34.4,24.2 U$3.2
  Top 0.203: U$3.2 34.31,22.84 34.92,22.23 36.2,22.23 37.15,21.27 U$1.48
N$2
  Top 0.2: C18.1 36.8,26.6 36.8,24.2 U$3.1
  Top 0.203: U$3.1 36.83,24.11 36.83,22.86 37.47,22.23 38.1,22.23 38.39,21.93 U$1.47
N$3
  Top 0.203: U$1.46 38.89,22.07 38.1,22.86 C3.1
N$4
  Top 0.203: IC1.30 19.57,22.98 19.68,22.86 R7.2
N$5
  Top 0.305: U$17.A R14.2
N$6
  Top 0.203: IC1.22 17.26,18.62 17.46,18.41 18.1,18.41 18.41,18.1 R12.2
N$7
  Top 0.305: C4.1 40.64,25.4 40.39,25.15 U$1.43
N$9  (via drill 0.3)
  Top 0.203: IC1.31 18.83,23.5 v20,23.5 | U$2.4 21.39,7.94 v21.91,7.94
  Route2 0.203: v21.91,7.94 22.54,8.57 22.54,12.38 20.95,13.97 20.95,17.78 20.32,18.41 20.32,23.18 v20,23.5
N$10
  Top 0.203: IC1.2 17.78,24.55 17.78,25.4 19.05,26.67 R8.2
N$11
  Top 0.203: R11.2 16.76,17.55 IC1.21
N$16
  Top 0.203: R1.2 33.34,33.97 34.33,32.98 U$6.5
N$17  (via drill 0.3)
  Top 0.203: U$2.2 20.07,6.6 v20.32,6.35 | v19.68,24.45 19.21,23.98 IC1.32
  Route3 0.203: v20.32,6.35 18.73,6.35 17.46,7.62 17.46,10.79 18.41,11.75 18.41,18.1 18.1,18.41 18.1,22.86 v19.68,24.45
N$18  (1 unrouted)
  Top 1.016: U$13.1 10.48,46.64 10.48,40.32
N$19
  Top 0.406: R13.1 U$16.A
N$22
  Top 0.305: U$18.A R15.2
P03
  Top 0.203: U$1.22 42.39,11.59 42.55,11.43 43.81,11.43 44.45,10.79 44.45,8.89 45.09,8.26 50.8,8.26 53.34,5.71 55.24,5.71 56.52,4.45 57.78,4.45 58.42,3.81 U$10.A3
P04
  Top 0.203: U$1.23 42.89,12.36 43.18,12.06 44.13,12.06 45.4,10.79 45.4,9.21 45.72,8.89 51.12,8.89 53.66,6.35 54.29,6.35 55.24,7.3 55.24,9.21 55.72,9.68 U$9.9
P20
  Top 0.203: U$1.15 38.89,7.46 40.01,6.35 50.16,6.35 50.8,5.71 U$10.A0
P21
  Top 0.203: U$1.16 39.39,7.6 40.01,6.99 50.8,6.99 51.44,6.35 51.44,5.08 52.07,4.45 52.7,4.45 53.34,3.81 U$10.A1
P22
  Top 0.203: U$1.17 39.89,8.37 40.64,7.62 50.8,7.62 52.07,6.35 52.07,5.71 52.7,5.08 55.24,5.08 55.88,4.45 U$10.A2
P23  (via drill 0.3)
  Top 0.203: U$16.C 8.57,36.7 v8.57,35.56 | U$1.18 40.39,14.22 v40.32,14.29
  Route3 0.203: v8.57,35.56 13.34,30.8 14.61,30.8 16.51,28.89 30.48,28.89 33.34,26.04 33.34,24.13 33.02,23.81 32.07,23.81 31.75,23.5 31.75,18.73 33.66,16.83 33.66,15.24 34.29,14.61 35.24,14.61 36.2,13.65 39.05,13.65 39.69,14.29 v40.32,14.29
P30  (via drill 0.3)
  Top 0.203: U$1.4 35.58,18.39 v34.92,19.05 | v32.7,23.18 31.11,21.59 v23.5,21.59 23.5,22.84 R7.1 | U$12.6_1 v5.08,12.38 | v57.15,32.38 55.88,32.38 54.93,31.43 54.93,30.48 53.98,29.53 53.98,25.4 53.02,24.45 53.02,22.86 51.75,21.59 v50.48,21.59
  Route3 0.203: v34.92,19.05 34.92,22.54 34.29,23.18 v32.7,23.18 | v5.08,12.38 5.08,12.4 5.2,12.52 5.33,12.38 7.94,12.38 8.89,13.34 9.21,13.34 12.06,16.19 12.06,18.1 13.97,20 17.14,20 17.46,20.32 17.46,23.5 19.05,25.08 20.64,25.08 20.95,24.77 20.95,22.23 21.59,21.59 v23.5,21.59
  Bottom 0.203: v57.15,32.38 63.5,38.73 U$10.0 | v34.92,19.05 34.92,21.27 35.56,21.91 36.51,21.91 36.83,21.59 41.91,21.59 43.81,19.68 46.67,19.68 47.31,20.32 50.16,20.32 50.48,20.64 v50.48,21.59
P31  (via drill 0.3)
  Top 0.203: U$1.5 34.49,17.89 v33.97,18.41 | U$12.5_1 v6.35,13.02 | R8.1 v24.77,26.67 28.57,22.86 v31.11,22.86
  Route2 0.203: v51.44,31.43 51.44,32.38 52.39,33.34 56.83,33.34 v57.15,33.66
  Route3 0.2: 7.6,13.07 6.4,13.07 v6.35,13.02
  Route3 0.203: v51.44,31.43 51.44,23.5 51.12,23.18 49.85,23.18 v48.58,21.91 | 7.6,13.07 8.5,13.97 9.21,13.97 11.43,16.19 11.43,18.41 13.65,20.64 16.51,20.64 16.83,20.95 16.83,23.81 19.68,26.67 v24.77,26.67
  Bottom 0.203: v57.15,33.66 60.96,37.47 U$10.1 | v33.97,18.41 33.97,21.27 | 33.97,21.27 35.24,22.54 36.51,22.54 36.83,22.23 41.91,22.23 43.81,20.32 46.35,20.32 46.99,20.95 48.26,20.95 48.58,21.27 v48.58,21.91 | v31.11,22.86 32.7,21.27 33.97,21.27
P32  (via drill 0.3)
  Top 0.2: 34.8,17 v34.92,17.14
  Top 0.203: U$1.6 35.17,17.39 v34.92,17.14 | v50.48,32.38 50.48,33.02 51.44,33.97 v51.44,34.92
  Route3 0.203: v50.48,32.38 50.8,32.07 50.8,24.13 50.48,23.81 49.21,23.81 47.62,22.23 47.62,21.27 48.26,20.64 49.21,20.64 49.53,20.32 49.53,19.37 49.85,19.05 v50.8,19.05
  Bottom 0.203: v34.92,17.14 37.47,17.14 38.1,17.78 38.73,17.78 39.37,18.41 41.91,18.41 42.55,17.78 43.81,17.78 44.45,18.41 50.48,18.41 50.8,18.73 v50.8,19.05 | v51.44,34.92 51.44,43.18 48.26,46.35 U$10.6
P33  (via drill 0.3)
  Top 0.203: U$1.7 38.48,16.89 v38.73,17.14
  Route2 0.2: 50,34.8 v50.16,34.92
  Route2 0.203: v38.73,17.14 38.73,17.78 40.01,19.05 40.64,19.05 41.27,19.68 41.27,25.4 41.91,26.04 42.23,26.04 43.81,27.62 43.81,33.34 44.13,33.66 47.62,33.66 47.94,33.97 49.53,33.97 50.16,34.61 v50.16,34.92
  Bottom 0.203: v50.16,34.92 50.16,43.18 45.72,47.62 U$10.7
P34  (via drill 0.3)
  Top 0.203: U$1.8 38.85,16.39 v39.37,16.51
  Route3 0.203: U$10.A4 60.96,3.81 60.33,4.45 40.64,4.45 39.37,5.71 39.37,10.79 40.96,12.38 40.96,14.92 v39.37,16.51 40.64,16.51 41.27,17.14 41.27,26.67 41.91,27.3 41.91,29.84 41.27,30.48 v41.27,34.92 41.27,46.99 40.64,47.62 22.86,47.62 21.34,49.15 U$10.SDA
P35  (via drill 0.3)
  Top 0.203: U$1.9 38.72,15.89 38.73,15.88 40.64,15.88 | 40.64,15.88 v41.27,15.88 | 40.64,15.88 40.64,17.14 v40.01,17.78
  Route3 0.203: v41.27,15.88 41.91,15.56 41.91,12.7 40.01,10.79 40.01,6.35 41.27,5.08 62.87,5.08 63.5,4.45 U$10.A5 | v40.01,17.78 40.64,18.41 40.64,26.67 41.27,27.3 41.27,29.84 40.01,31.11 v40.01,34.92 40.01,45.72 38.73,46.99 20.32,46.99 18.8,48.51 U$10.SCL
P36  (via drill 0.3)
  Top 0.203: U$1.10 37.63,15.39 v37.95,15.08
  Route2 0.2: 42.6,34.8 v42.55,34.92
  Route2 0.203: v37.95,15.08 37.95,16.03 37.47,16.51 37.47,17.78 40.01,20.32 40.01,25.4 41.91,27.3 42.23,27.3 42.55,27.62 v42.55,34.92 42.55,35.56 43.18,36.2 43.81,36.2 44.45,36.83 60.64,36.83 61.59,35.88 61.59,34.92 64.77,31.75 64.77,29.08 U$10.SCK
  Route3 0.203: v42.55,34.92 42.55,46.99 41.27,48.26 29.84,48.26 28.96,49.15 U$10.13
P37  (via drill 0.3)
  Top 0.203: U$1.11 37.17,14.89 37.78,14.29 v38.73,14.29
  Route2 0.2: 46.2,34.8 v46.35,34.92
  Route2 0.203: v38.73,14.29 38.73,15.88 38.1,16.51 38.1,17.78 40.64,20.32 40.64,25.4 41.91,26.67 42.23,26.67 43.18,27.62 43.18,33.97 43.5,34.29 46.04,34.29 46.35,34.61 v46.35,34.92
  Bottom 0.203: v46.35,34.92 46.35,43.81 42.55,47.62 38.1,47.62 36.58,49.15 U$10.10
P42  (via drill 0.3)
  Top 0.203: U$1.27 48.41,15.39 v49.53,16.51
  Route3 0.203: v49.53,16.51 51.75,16.51 53.34,18.1 53.34,32.07 53.98,32.7 v53.98,34.92
  Bottom 0.203: v53.98,34.92 53.98,43.18 53.34,43.81 U$10.4
P43  (via drill 0.3)
  Top 0.203: U$1.28 47.96,15.89 v48.26,16.19
  Route3 0.203: v48.26,16.19 49.21,17.14 51.44,17.14 52.7,18.41 v52.7,34.92
  Bottom 0.203: v52.7,34.92 52.7,43.18 50.8,45.09 U$10.5
P44  (via drill 0.3)
  Top 0.203: U$1.29 47.19,16.39 v47.62,16.83
  Route3 0.203: v47.62,16.83 47.62,17.46 46.35,18.73 46.35,32.7 45.09,33.97 v45.09,34.92 45.72,35.56 60.96,35.56 62.23,34.29 62.23,29.84 62.87,29.21 65.41,29.21 66.17,28.45 U$10.MOSI
  Bottom 0.203: v45.09,34.92 45.09,44.45 42.55,46.99 36.83,46.99 34.04,49.78 U$10.11
P45  (via drill 0.3)
  Top 0.203: U$1.30 46.1,16.89 v46.35,17.14
  Route2 0.203: v43.81,34.92 45.09,36.2 60.33,36.2 60.96,35.56 60.96,33.66 63.63,30.99 U$10.MISO
  Route3 0.203: v46.35,17.14 46.35,17.78 45.72,18.41 45.72,32.7 43.81,34.61 v43.81,34.92 43.81,46.99 41.91,48.9 31.75,48.9 31.5,49.15 U$10.12
P50  (via drill 0.3)
  Top 0.2: 57,34.8 v57.15,34.92
  Top 0.203: U$1.33 47.6,18.39 48.26,19.05 48.26,20.64 49.85,22.23 51.75,22.23 52.39,22.86 52.39,24.77 53.34,25.72 53.34,29.84 54.29,30.8 54.29,32.07 v57.15,34.92
  Bottom 0.203: v57.15,34.92 58.42,36.2 U$10.2
P51  (via drill 0.3)
  Top 0.203: U$1.34 46.84,18.89 v47.62,19.68 | v52.07,20.95 53.66,22.54 53.66,24.13 54.61,25.08 54.61,28.77 U$17.C
  Route3 0.203: v52.07,20.95 52.07,18.73 51.44,18.1 48.58,18.1 48.26,18.41 48.26,19.37 47.94,19.68 v47.62,19.68
P52  (via drill 0.3)
  Top 0.203: U$1.35 46.38,19.39 47.94,20.95 47.94,22.23 48.58,22.86 51.44,22.86 51.75,23.18 51.75,25.4 v52.07,25.72
  Route3 0.203: v52.07,25.72 52.07,32.07 50.8,33.34 47.94,33.34 47.62,33.66 v47.62,34.92
  Bottom 0.203: v47.62,34.92 47.62,43.18 42.55,48.26 40.01,48.26 39.12,49.15 U$10.9
P53  (via drill 0.3)
  Top 0.203: v55.24,34.92 55.24,33.97 53.66,32.38 53.66,31.11 52.7,30.16 52.7,27.3 51.12,25.72 51.12,23.81 50.8,23.5 48.58,23.5 47.31,22.23 47.31,20.95 46.25,19.89 U$1.36
  Bottom 0.203: v55.24,34.92 55.88,35.56 U$10.3
P56  (via drill 0.3)
  Top 0.203: U$1.39 42.39,22.07 43.5,23.18 v44.45,23.18 | v56.83,25.4 55.88,25.4 55.56,25.72 55.56,27.43 U$18.C
  Route2 0.203: v44.45,23.18 46.67,23.18 46.99,23.5 55.88,23.5 56.83,24.45 v56.83,25.4
P57  (via drill 0.3)
  Top 0.2: 48.8,34.8 v48.9,34.92
  Top 0.203: U$1.40 41.89,22.2 42.55,22.86 42.55,33.66 43.18,34.29 48.58,34.29 48.9,34.61 v48.9,34.92
  Bottom 0.203: v48.9,34.92 48.9,43.18 41.66,50.42 U$10.8
RESETN  (via drill 0.3)  (1 unrouted)
  Top 0.203: 33.02,4.45 33.02,19.68 33.23,19.89 U$1.1 36.52,20.64 v36.2,20.95 | U$7.2 3.2,2.86 | 33.02,4.45 32.38,5.08 27.3,5.08 26.04,3.81 17.46,3.81 15.56,5.71 12.38,5.71 9.75,3.08 U$7.1 | 63.5,25.4 62.87,24.77 55.16,24.77 54.29,23.89 54.29,21.59 52.5,19.8 50.2,19.8 50.16,19.77 v50.16,19.68 | 33.02,4.45 U$10.RESETB$1
  Top 0.305: 3.2,2.86 3.42,3.08 U$7.1
  Bottom 0.203: v36.2,20.95 38.73,20.95 40.01,19.68 41.27,19.68 41.91,20.32 42.55,20.32 43.81,19.05 49.53,19.05 v50.16,19.68
RF_CSB  (via drill 0.3)
  Top 0.203: U$9.14 61.71,10.68 v62.23,10.16 | U$20.15 74.73,19.25 v74.93,19.05
  Route2 0.203: v62.23,10.16 64.14,10.16 64.77,10.79 67.94,10.79 68.58,11.43 68.58,13.34 70.48,15.24 73.03,15.24 73.66,15.88 74.3,15.88 74.93,16.51 v74.93,19.05
RF_CSBI  (via drill 0.3)
  Top 0.203: v42.2,19.39 U$1.2 | U$9.7 54.09,10.68 v52.7,9.53
  Route3 0.203: v52.7,9.53 41.27,9.53 40.64,10.16 40.64,10.79 42.55,12.7 42.55,17.78 42.2,18.12 v42.2,19.39
RF_IRQ  (via drill 0.3)
  Top 0.203: U$9.16 64.39,11.68 v64.77,12.06 | U$20.13 74.66,20.05 v74.93,20.32
  Route3 0.203: v64.77,12.06 66.67,12.06 67.31,12.7 67.31,13.34 70.48,16.51 70.48,17.78 71.75,19.05 73.66,19.05 v74.93,20.32
RF_IRQI
  Top 0.203: U$9.5 52.45,11.68 52.07,12.06 52.07,17.14 51.32,17.89 U$1.32
RF_REGPDIN  (via drill 0.3)
  Top 0.203: U$9.18 62.84,12.68 v63.5,13.34 | v68.58,21.59 69.06,21.11 69.27,20.9 69.32,20.85 U$20.10
  Route3 0.203: v68.58,21.59 67.31,21.59 66.67,20.32 66.67,14.61 65.41,13.34 v63.5,13.34
RF_REGPDINI  (via drill 0.3)
  Top 0.203: U$1.37 43.49,21.27 v44.45,22.23 | U$9.3 53.99,12.68 52.7,13.97 52.7,15.24 54.61,17.14 55.56,17.14 56.52,18.1 56.52,20.64 55.56,21.59 v55.24,21.59
  Route2 0.203: v55.24,21.59 55.24,21.91 54.29,22.86 47.31,22.86 46.67,22.23 v44.45,22.23
RF_RSTB  (via drill 0.3)
  Top 0.203: U$9.19 62.08,13.18 v62.87,13.97 | v74.3,22.23 74.3,21.59 73.56,20.85 U$20.11
  Route2 0.305: v62.87,13.97 v62.87,22.23
  Route3 0.203: v74.3,22.23 v62.87,22.23
RF_RSTBI  (via drill 0.3)
  Top 0.203: U$9.2 54.77,13.18 v53.98,13.97 | v43.18,18.41 39.37,18.41 38.89,18.89 U$1.3
  Route3 0.203: v53.98,13.97 53.34,14.61 52.7,14.61 51.44,13.34 51.44,12.06 50.8,11.43 44.45,11.43 43.18,12.7 v43.18,18.41
SCL0  (via drill 0.3)
  Top 0.203: R5.1 v64.14,17.78 64.14,17.14 64.77,16.51 67.94,16.51 68.69,17.25 U$20.1 | v60.33,17.78 60.33,17.82 60.19,17.82 U$8.7
  Route3 0.203: v60.33,17.78 v64.14,17.78
SCL0I  (via drill 0.3)
  Top 0.203: U$1.26 47.97,14.89 48.9,13.97 | 48.9,13.97 R4.1 | v49.53,14.61 48.9,13.97 | U$8.2 59.05,20.32 v58.42,20.95
  Route3 0.203: v58.42,20.95 57.15,20.95 56.52,20.32 56.52,19.68 55.88,19.05 55.24,19.05 53.98,17.78 53.98,16.51 53.34,15.88 52.7,15.88 50.8,13.97 50.16,13.97 v49.53,14.61
SCLK0  (via drill 0.3)
  Top 0.203: U$9.15 62.48,11.18 v62.87,10.79 | v71.75,19.68 71.77,19.7 71.82,19.65 U$20.14
  Route2 0.203: v62.87,10.79 64.14,10.79 64.77,11.43 67.31,11.43 67.94,12.06 67.94,13.34 71.12,16.51 71.12,17.78 71.75,18.41 v71.75,19.68
SCLK0I  (via drill 0.3)
  Top 0.203: U$9.6 53.09,11.18 v52.07,10.16 | v43.18,10.79 42.55,10.79 41.91,11.43 41.91,13 U$1.21
  Route3 0.203: v52.07,10.16 43.81,10.16 v43.18,10.79
SDA0  (via drill 0.3)
  Top 0.203: R6.1 v65.41,17.78 66.04,17.14 67.94,17.14 68.45,17.65 U$20.2 | v59.69,17.14 59.05,17.78 U$8.6
  Route3 0.203: v65.41,17.78 65.41,17.14 64.77,16.51 61.59,16.51 60.96,17.14 v59.69,17.14
SDA0I  (via drill 0.3)
  Top 0.203: R3.1 46.37,13.35 46.35,13.34 | 46.35,13.34 45.83,13.34 U$1.25 | v46.35,13.97 46.35,13.34 | 58.55,19.55 U$8.3 58.45,19.66 v57.78,20.32
  Route3 0.203: v57.78,20.32 55.88,18.41 55.24,18.41 54.61,17.78 54.61,15.88 53.98,15.24 52.7,15.24 50.8,13.34 49.53,13.34 49.52,13.35 46.99,13.35 46.37,13.97 v46.35,13.97
TEST0  (via drill 0.3)
  Top 0.203: U$1.41 41.39,22.98 v41.91,23.5 | U$2.10 v18.41,8.89
  Route3 0.203: v18.41,8.89 18.41,10.48 29.84,21.91 29.84,24.13 30.8,25.08 v31.43,25.08
  Bottom 0.203: v41.91,23.5 42.55,24.13 42.55,27.62 41.91,28.26 33.34,28.26 32.07,26.99 32.07,25.72 v31.43,25.08
TEST1N  (via drill 0.3)
  Top 0.2: 33.4,23 33.4,24 32.8,24.6 v32.7,24.77
  Top 0.203: U$1.42 40.89,23.75 v41.91,24.77 | U$2.6 21.14,9.6 32.14,9.6 32.38,9.84 32.38,20 33.4,21.02 33.4,23
  Bottom 0.203: v41.91,24.77 41.91,26.99 41.27,27.62 33.66,27.62 32.7,26.67 v32.7,24.77
U_TEST0
  Top 0.203: R12.1 18.41,13.65 | 18.41,13.65 18.41,11.11 19.57,9.96 U$2.9 | U$12.7_1 4.13,10.48 4.13,12.7 5.08,13.65 18.41,13.65
U_TEST1N  (via drill 0.3)
  Top 0.203: U$2.7 20.57,10.41 v20.95,10.79 | v17.14,14.61 R11.1 | v17.14,11.43 16.83,11.75 8.26,11.75 7.62,11.11 U$12.4_1
  Route2 0.203: v20.95,10.79 20.64,10.48 18.1,10.48 v17.14,11.43 v17.14,14.61
USBVDD  (1 unrouted)
  Top 0.406: U$11.1 3.98,27.94 5.08,27.94 5.4,27.62 5.4,24.13 4.45,23.18 3.17,23.18 2.86,22.86 2.86,21.61
  Top 1.016: 16.24,43.83 U$15.A
VIN  (via drill 0.61)
  Top 1.016: v29.84,26.04 v29.84,27.3 27.46,29.69 | 27.46,29.69 27.3,29.84 27.3,33.66 26.75,34.21 U$5.1 21.67,34.21 22.23,33.66 22.23,30.48 22.54,30.16 22.54,30.61 C15.1 | U$14.C 10.48,32.7 11.43,31.75 13.34,31.75 16.83,28.26 26.04,28.26 27.46,29.69
  Route2 1.016: v29.84,27.3 v29.84,26.04 29.84,10.79 33.02,7.62 36.83,7.62 39.37,5.08 44.45,5.08 45.72,3.81 U$10.VIN

### Text on the board
tPlace: Lazurite SubGHz | 5V | 3V | rev3 | PWR | Designed in Japan / Manufactured in Japan | 25 | 26
bPlace: Homepage: | http://www.lapis-semi.com/lazurite-jp | Partner: | http://www.k-p-l.co.jp | manucacturing | http://www.sae.co.jp | IDE